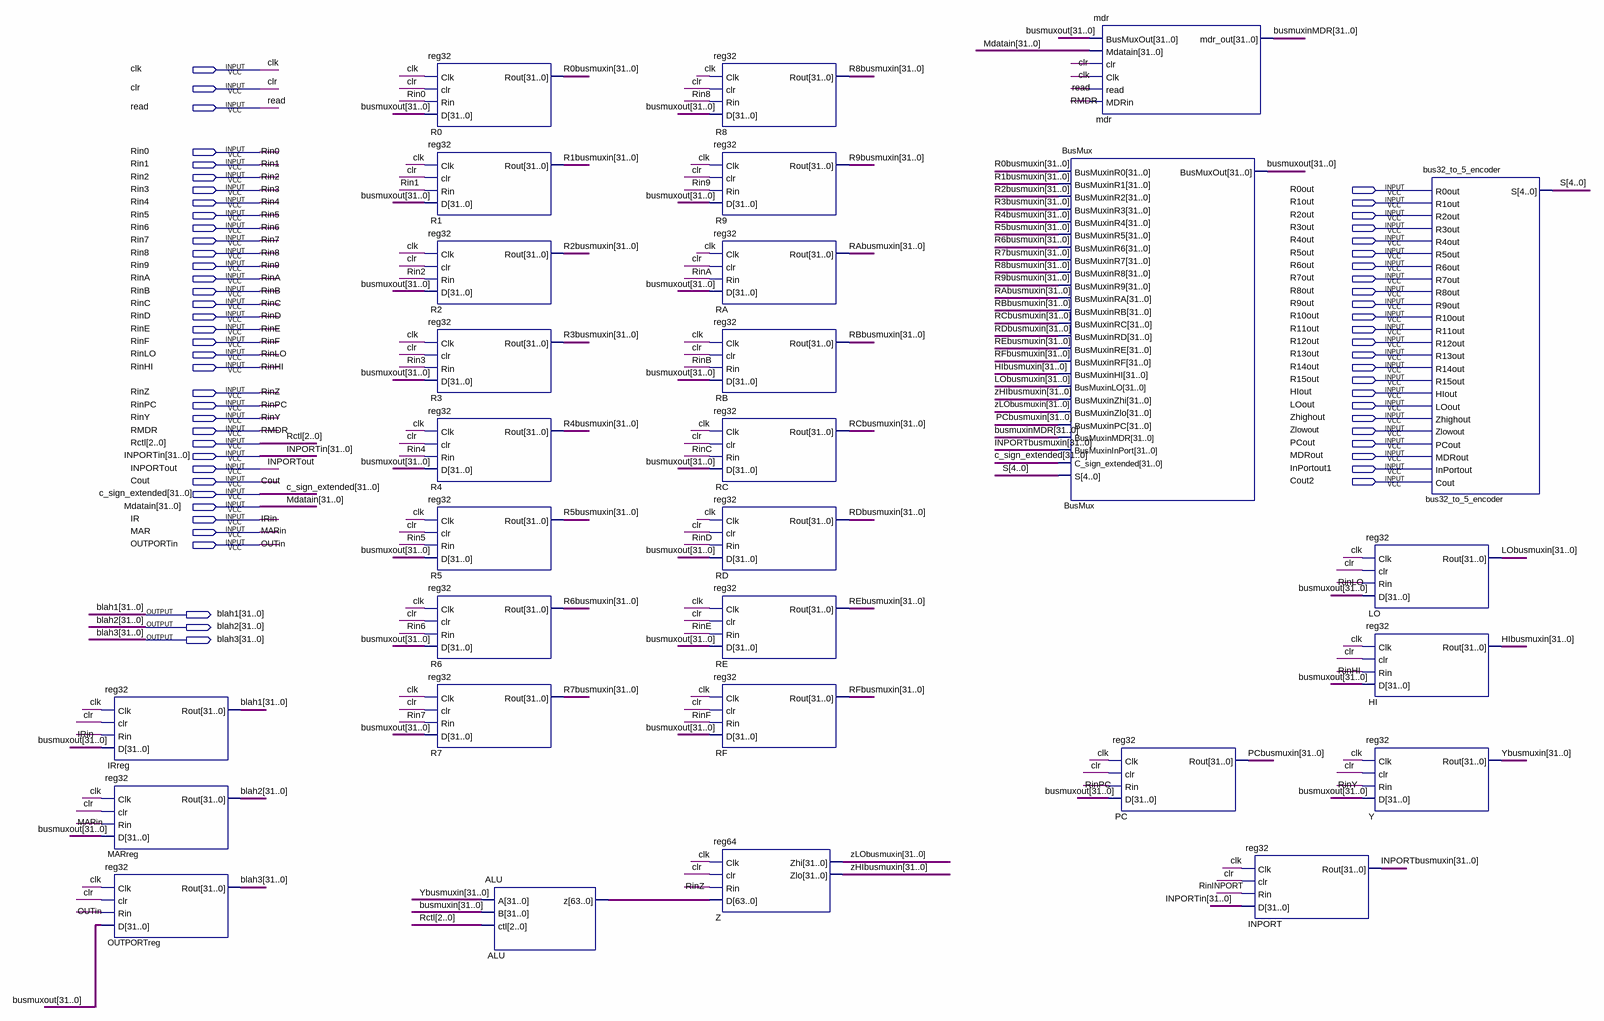
[diagram p0: schematic sheet]
// Quartus schematic Phase1.bdf as structural Verilog: 29 symbols, 61 pins
module Phase1 (
  input  clk,
  input  clr,
  input  read,
  input  Rin0,
  input  Rin1,
  input  Rin2,
  input  Rin3,
  input  R0out,
  input  Rin4,
  input  R1out,
  input  Rin5,
  input  R2out,
  input  Rin6,
  input  R3out,
  input  Rin7,
  input  R4out,
  input  Rin8,
  input  R5out,
  input  Rin9,
  input  R6out,
  input  RinA,
  input  R7out,
  input  RinB,
  input  R8out,
  input  RinC,
  input  R9out,
  input  RinD,
  input  R10out,
  input  RinE,
  input  R11out,
  input  RinF,
  input  R12out,
  input  RinLO,
  input  R13out,
  input  RinHI,
  input  R14out,
  input  R15out,
  input  RinZ,
  input  HIout,
  input  RinPC,
  input  LOout,
  input  RinY,
  input  Zhighout,
  input  RMDR,
  input  Zlowout,
  input  [2:0] Rctl,
  input  PCout,
  input  [31:0] INPORTin,
  input  MDRout,
  input  INPORTout,
  input  InPortout1,
  input  Cout,
  input  Cout2,
  input  [31:0] c_sign_extended,
  input  [31:0] Mdatain,
  input  IR,
  input  MAR,
  input  OUTPORTin,
  output [31:0] blah1,
  output [31:0] blah2,
  output [31:0] blah3
);

  wire RinINPORT;
  wire [4:0] S;
  wire [31:0] busmuxin, busmuxinMDR, busmuxout, HIbusmuxin, INPORTbusmuxin, LObusmuxin, PCbusmuxin,
       R0busmuxin, R1busmuxin, R2busmuxin, R3busmuxin, R4busmuxin, R5busmuxin, R6busmuxin, R7busmuxin,
       R8busmuxin, R9busmuxin, RAbusmuxin, RBbusmuxin, RCbusmuxin, RDbusmuxin, REbusmuxin, RFbusmuxin,
       Ybusmuxin, zHIbusmuxin, zLObusmuxin;
  wire [63:0] ALU_z;

  reg32 IRreg (.Clk(clk), .clr(clr), .Rin(IR), .D(busmuxout), .Rout(blah1));
  reg32 MARreg (.Clk(clk), .clr(clr), .Rin(MAR), .D(busmuxout), .Rout(blah2));
  reg32 OUTPORTreg (.Clk(clk), .clr(clr), .Rin(OUTPORTin), .D(busmuxout), .Rout(blah3));
  reg32 R0 (.Clk(clk), .clr(clr), .Rin(Rin0), .D(busmuxout), .Rout(R0busmuxin));
  reg32 R1 (.Clk(clk), .clr(clr), .Rin(Rin1), .D(busmuxout), .Rout(R1busmuxin));
  reg32 R2 (.Clk(clk), .clr(clr), .Rin(Rin2), .D(busmuxout), .Rout(R2busmuxin));
  reg32 R3 (.Clk(clk), .clr(clr), .Rin(Rin3), .D(busmuxout), .Rout(R3busmuxin));
  reg32 R4 (.Clk(clk), .clr(clr), .Rin(Rin4), .D(busmuxout), .Rout(R4busmuxin));
  reg32 R5 (.Clk(clk), .clr(clr), .Rin(Rin5), .D(busmuxout), .Rout(R5busmuxin));
  reg32 R6 (.Clk(clk), .clr(clr), .Rin(Rin6), .D(busmuxout), .Rout(R6busmuxin));
  reg32 R7 (.Clk(clk), .clr(clr), .Rin(Rin7), .D(busmuxout), .Rout(R7busmuxin));
  ALU ALU (.A(Ybusmuxin), .B(busmuxin), .ctl(Rctl), .z(ALU_z));
  reg32 R8 (.Clk(clk), .clr(clr), .Rin(Rin8), .D(busmuxout), .Rout(R8busmuxin));
  reg32 R9 (.Clk(clk), .clr(clr), .Rin(Rin9), .D(busmuxout), .Rout(R9busmuxin));
  reg32 RA (.Clk(clk), .clr(clr), .Rin(RinA), .D(busmuxout), .Rout(RAbusmuxin));
  reg32 RB (.Clk(clk), .clr(clr), .Rin(RinB), .D(busmuxout), .Rout(RBbusmuxin));
  reg32 RC (.Clk(clk), .clr(clr), .Rin(RinC), .D(busmuxout), .Rout(RCbusmuxin));
  reg32 RD (.Clk(clk), .clr(clr), .Rin(RinD), .D(busmuxout), .Rout(RDbusmuxin));
  reg32 RE (.Clk(clk), .clr(clr), .Rin(RinE), .D(busmuxout), .Rout(REbusmuxin));
  reg32 RF (.Clk(clk), .clr(clr), .Rin(RinF), .D(busmuxout), .Rout(RFbusmuxin));
  reg64 Z (.Clk(clk), .clr(clr), .Rin(RinZ), .D(ALU_z), .Zhi(zLObusmuxin), .Zlo(zHIbusmuxin));
  BusMux BusMux (
    .BusMuxinR0(R0busmuxin), .BusMuxinR1(R1busmuxin), .BusMuxinR2(R2busmuxin), .BusMuxinR3(R3busmuxin),
    .BusMuxinR4(R4busmuxin), .BusMuxinR5(R5busmuxin), .BusMuxinR6(R6busmuxin), .BusMuxinR7(R7busmuxin),
    .BusMuxinR8(R8busmuxin), .BusMuxinR9(R9busmuxin), .BusMuxinRA(RAbusmuxin), .BusMuxinRB(RBbusmuxin),
    .BusMuxinRC(RCbusmuxin), .BusMuxinRD(RDbusmuxin), .BusMuxinRE(REbusmuxin), .BusMuxinRF(RFbusmuxin),
    .BusMuxinHI(HIbusmuxin), .BusMuxinLO(LObusmuxin), .BusMuxinZhi(zHIbusmuxin), .BusMuxinZlo(zLObusmuxin),
    .BusMuxinPC(PCbusmuxin), .BusMuxinMDR(busmuxinMDR), .BusMuxinInPort(INPORTbusmuxin),
    .C_sign_extended(c_sign_extended), .S(S), .BusMuxOut(busmuxout));
  mdr mdr (
    .BusMuxOut(busmuxout), .Mdatain(Mdatain), .clr(clr), .Clk(clk), .read(read), .MDRin(RMDR),
    .mdr_out(busmuxinMDR));
  reg32 PC (.Clk(clk), .clr(clr), .Rin(RinPC), .D(busmuxout), .Rout(PCbusmuxin));
  reg32 INPORT (.Clk(clk), .clr(clr), .Rin(RinINPORT), .D(INPORTin), .Rout(INPORTbusmuxin));
  reg32 LO (.Clk(clk), .clr(clr), .Rin(RinLO), .D(busmuxout), .Rout(LObusmuxin));
  reg32 HI (.Clk(clk), .clr(clr), .Rin(RinHI), .D(busmuxout), .Rout(HIbusmuxin));
  reg32 Y (.Clk(clk), .clr(clr), .Rin(RinY), .D(busmuxout), .Rout(Ybusmuxin));
  bus32_to_5_encoder bus32_to_5_encoder (
    .R0out(R0out), .R1out(R1out), .R2out(R2out), .R3out(R3out), .R4out(R4out), .R5out(R5out), .R6out(R6out),
    .R7out(R7out), .R8out(R8out), .R9out(R9out), .R10out(R10out), .R11out(R11out), .R12out(R12out),
    .R13out(R13out), .R14out(R14out), .R15out(R15out), .HIout(HIout), .LOout(LOout), .Zhighout(Zhighout),
    .Zlowout(Zlowout), .PCout(PCout), .MDRout(MDRout), .InPortout(InPortout1), .Cout(Cout2), .S(S));

  // Other names for the same wires on the sheet: IRin = IR; MARin = MAR; OUTin = OUTPORTin
endmodule
